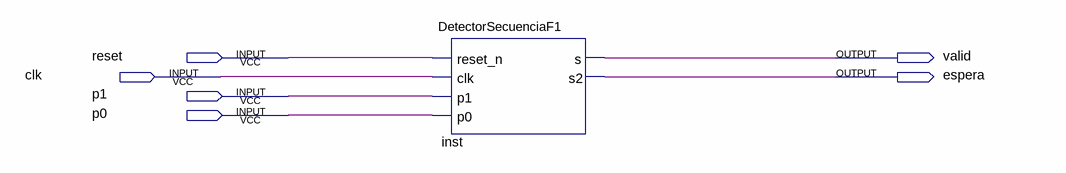
[diagram p0: schematic sheet]
// Quartus schematic Practica9.bdf as structural Verilog: 1 symbols, 6 pins
module Practica9 (
  input  reset,
  input  clk,
  input  p1,
  input  p0,
  output valid,
  output espera
);

  DetectorSecuenciaF1 inst (.reset_n(reset), .clk(clk), .p1(p1), .p0(p0), .s(valid), .s2(espera));
endmodule
